# EAGLE design 5V ADC mbed (EAGLE 5.11)
BOM: EXCLUDE; PARTNO: ADC128S102CIMT
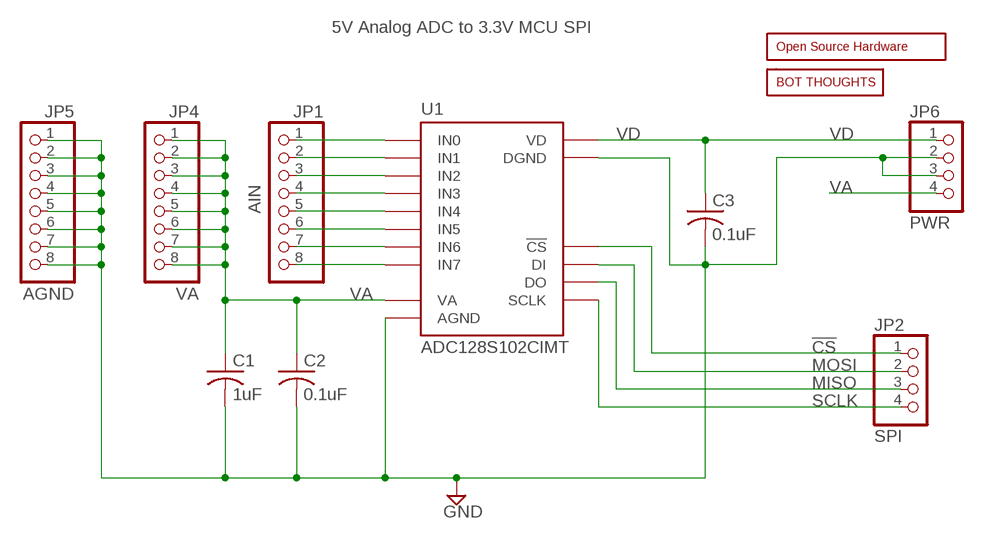
[diagram p0: schematic, sheet 1]

## Parts
C1  1uF  C-USC0603  [C0603]
C2  0.1uF  C-USC0603  [C0603]
C3  0.1uF  C-USC0603  [C0603]
JP1  AIN  PINHD-1X08_2.54-S  [1X08-S]
JP2  SPI  PINHD-1X04_2.54-S  [1X04-S]
JP4  VA  PINHD-1X08_2.54-S  [1X08-S]
JP5  AGND  PINHD-1X08_2.54-S  [1X08-S]
JP6  PWR  PINHD-1X04_2.54-S  [1X04-S]
U1  ADC128S102CIMT  [TSSOP16]
U$3  OSHW  [OSH1]
U$4  BOT-THOUGHTS  [BOT-THOUGHTS]

## Nets
!CS: JP2.1 U1.1(!CS)
GND: C1.2 C2.2 C3.2 JP5.1 JP5.2 JP5.3 JP5.4 JP5.5 JP5.6 JP5.7 JP5.8 JP6.2 JP6.3 U1.3(AGND) U1.12(DGND)
MISO: JP2.3 U1.15(DO)
MOSI: JP2.2 U1.14(DI)
N$1: JP1.1 U1.4(IN0)
N$2: JP1.2 U1.5(IN1)
N$3: JP1.3 U1.6(IN2)
N$4: JP1.4 U1.7(IN3)
N$5: JP1.5 U1.8(IN4)
N$6: JP1.6 U1.9(IN5)
N$7: JP1.7 U1.10(IN6)
N$8: JP1.8 U1.11(IN7)
SCLK: JP2.4 U1.16(SCLK)
VA: C1.1 C2.1 JP4.1 JP4.2 JP4.3 JP4.4 JP4.5 JP4.6 JP4.7 JP4.8 JP6.4 U1.2(VA)
VD: C3.1 JP6.1 U1.13(VD)

## Notes on the sheet
- 5V Analog ADC to 3.3V MCU SPI

## Library data of the parts
C1-C3 = rcl:C-US: CAPACITOR, American symbol
JP1 JP4 JP5 = pinhead-2:PINHD-1X08: PIN HEADER
JP2 JP6 = pinhead-2:PINHD-1X04: PIN HEADER
U1 = mes:ADC128S: ADC128S102 The ADC128S102 is a low-power, eight-channel CMOS 12- bit analog-to-digital converter specified for conversion throughput rates of 500 ksps to 1 MSPS, featuring output serial data that is straight binary and is compatible with several standards, such as SPI?, QSPI?, MICROWIRE?, and many common DSP serial interfaces.
U$3 = mes:OSHW
U$4 = mes:BOT-THOUGHTS

## Board
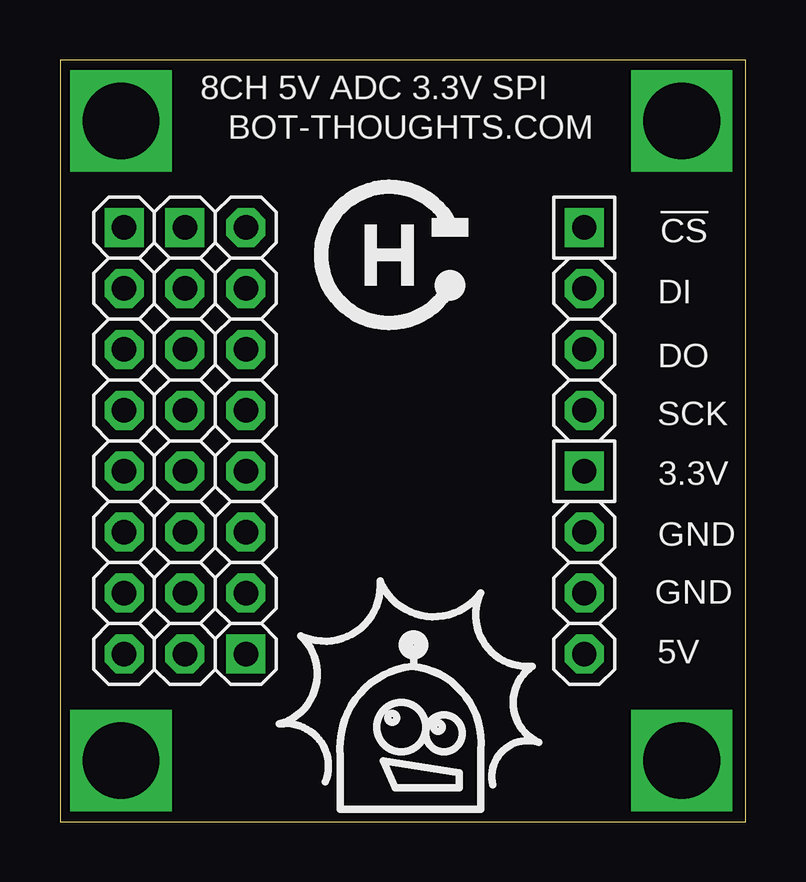
[diagram p1: board, top side]
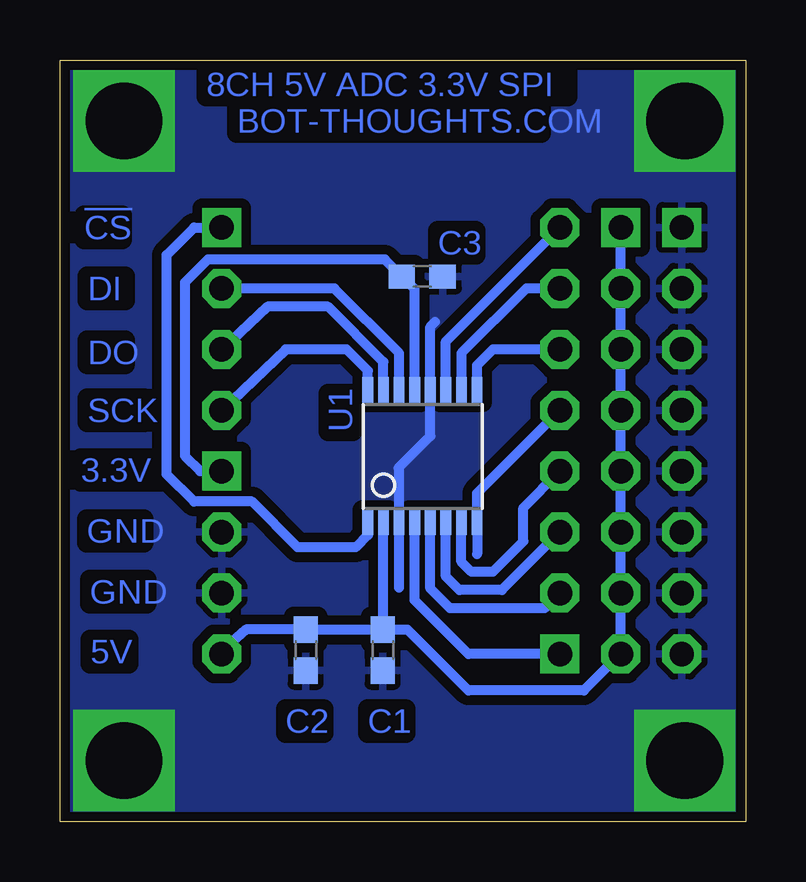
[diagram p2: board, bottom side, seen from below]

Size 28.57 x 31.75 mm. Coordinates in mm from the lower left corner, seen from the top.
Outline: 0,0 28.57,0 28.57,31.75 0,31.75 0,0
Copper layers (1*16): Top 0.035mm / dielectric 1.5mm / Bottom 0.035mm
Design rules "SparkFun": minimum track width 8mil, minimum drill 20mil, track to track 8mil, track to pad 8mil, pad to pad 8mil, via to via 8mil, smd to smd 8mil, copper to edge 10mil, drill to drill 8mil, minimum pad ring 12mil, minimum via ring 10mil, stop-mask expansion 4mil, vias tented up to drill 25mil, thermal gap 10mil

### Footprints (pad centres in the part's own frame; a part is rotated, then mirrored left to right if it is on the bottom)
C0603 = smd 1.1 x 1: 1 -0.85,0; 2 0.85,0
1X08-S = drill 1.016 square: 1 -8.89,0 | drill 1.016 octagon: 2 -6.35,0; 3 -3.81,0; 4 -1.27,0; 5 1.27,0; 6 3.81,0; 7 6.35,0; 8 8.89,0
1X04-S = drill 1.016 square: 1 -3.81,0 | drill 1.016 octagon: 2 -1.27,0; 3 1.27,0; 4 3.81,0
TSSOP16 = smd 0.45 x 1.05: 1 -2.275,-2.768; 2 -1.625,-2.768; 3 -0.975,-2.768; 4 -0.325,-2.768; 5 0.325,-2.768; 6 0.975,-2.768; 7 1.625,-2.768; 8 2.275,-2.768; 9 2.275,2.768; 10 1.625,2.768; 11 0.975,2.768; 12 0.325,2.768; 13 -0.325,2.768; 14 -0.975,2.768; 15 -1.625,2.768; 16 -2.275,2.768

### Placement (x,y rotation side)
C1  15.13,7.15 270 bottom
C2  18.34,7.15 270 bottom
C3  13.48,22.73 0 bottom
JP1  7.75,15.88 90 top
JP2  21.84,20.95 270 top
JP4  5.21,15.88 270 top
JP5  2.67,15.88 270 top
JP6  21.84,10.79 270 top
U1  13.47,15.23 0 bottom
U$3  13.72,23.62 0 top
U$4  14.99,2.79 0 top

### Tracks (layer width: path | path; a pad name or v marks a point on that pad's centre or on a via)
!CS
  Bottom 0.406: U1.1 15.75,11.94 16.26,11.43 18.67,11.43 20.57,13.34 22.99,13.34 24.13,14.48 24.13,22.61 24.13,23.62 22.99,24.77 JP2.1
GND  (via drill 3.2)
  Bottom 0.406: 14.45,9.75 U1.3 14.45,14.7 | 12.95,20.83 13.15,20.64 U1.12 13.15,16.06 14.48,14.73
  other vias: 25.91,2.54 2.54,2.54 2.54,29.21 25.91,29.21
  pour Bottom (isolate 0.406, rank 3): 0.15,31.71 28.44,31.71 28.44,-0.03 0.15,-0.03
MISO
  Bottom 0.406: U1.15 15.1,19.16 17.4,21.46 19.94,21.46 JP2.3
MOSI
  Bottom 0.406: U1.14 14.45,19.53 17.14,22.23 JP2.2
N$1
  Bottom 0.406: U1.4 13.8,9.22 11.56,6.99 JP1.1
N$2
  Bottom 0.406: U1.5 13.15,9.72 12.32,8.89 8.38,8.89 JP1.2
N$3
  Bottom 0.406: U1.6 12.5,10.21 11.94,9.65 10.16,9.65 JP1.3
N$4
  Bottom 0.406: U1.7 11.85,10.83 11.43,10.41 10.54,10.41 9.27,11.68 9.27,13.08 JP1.4
N$5
  Bottom 0.406: 11.2,11.15 U1.8 11.2,13.7 JP1.5
N$6
  Bottom 0.406: U1.9 11.21,18.89 11.21,19.02 10.54,19.68 JP1.6
N$7
  Bottom 0.406: U1.10 11.85,19.52 9.14,22.23 JP1.7
N$8
  Bottom 0.406: U1.11 12.5,20.02 JP1.8
SCLK
  Bottom 0.406: U1.16 15.75,18.8 16.64,19.68 19.18,19.68 JP2.4
VA
  Bottom 0.406: JP4.1 JP4.2 JP4.3 JP4.4 JP4.5 JP4.6 JP4.7 JP4.8 5.31,6.9 6.75,5.46 11.56,5.46 14.09,8 C1.1 | C1.1 C2.1 20.83,8 21.84,7.11 JP6.4 | U1.2 15.1,8.03 C1.1
VD
  Bottom 0.406: U1.13 13.8,22.19 C3.1 15.04,23.43 22.42,23.43 23.37,22.48 23.37,15.24 22.73,14.61 JP6.1

### Text on the board
Bottom: 8CH 5V ADC 3.3V SPI | BOT-THOUGHTS.COM | C3 | !CS | DI | DO | SCK | U1 | 3.3V | GND | GND | 5V | C1 | C2
tNames: 8CH 5V ADC 3.3V SPI | BOT-THOUGHTS.COM | !CS | DI | DO | SCK | 3.3V | GND | GND | 5V